# EAGLE design Controler 3_5 (EAGLE 9.0.0)
CNAME: Franks FlightSim Boards; CPROJECT: Franks FlightSim Boards; CREVISION: v0.1; DESIGNER: Frank van Ierland
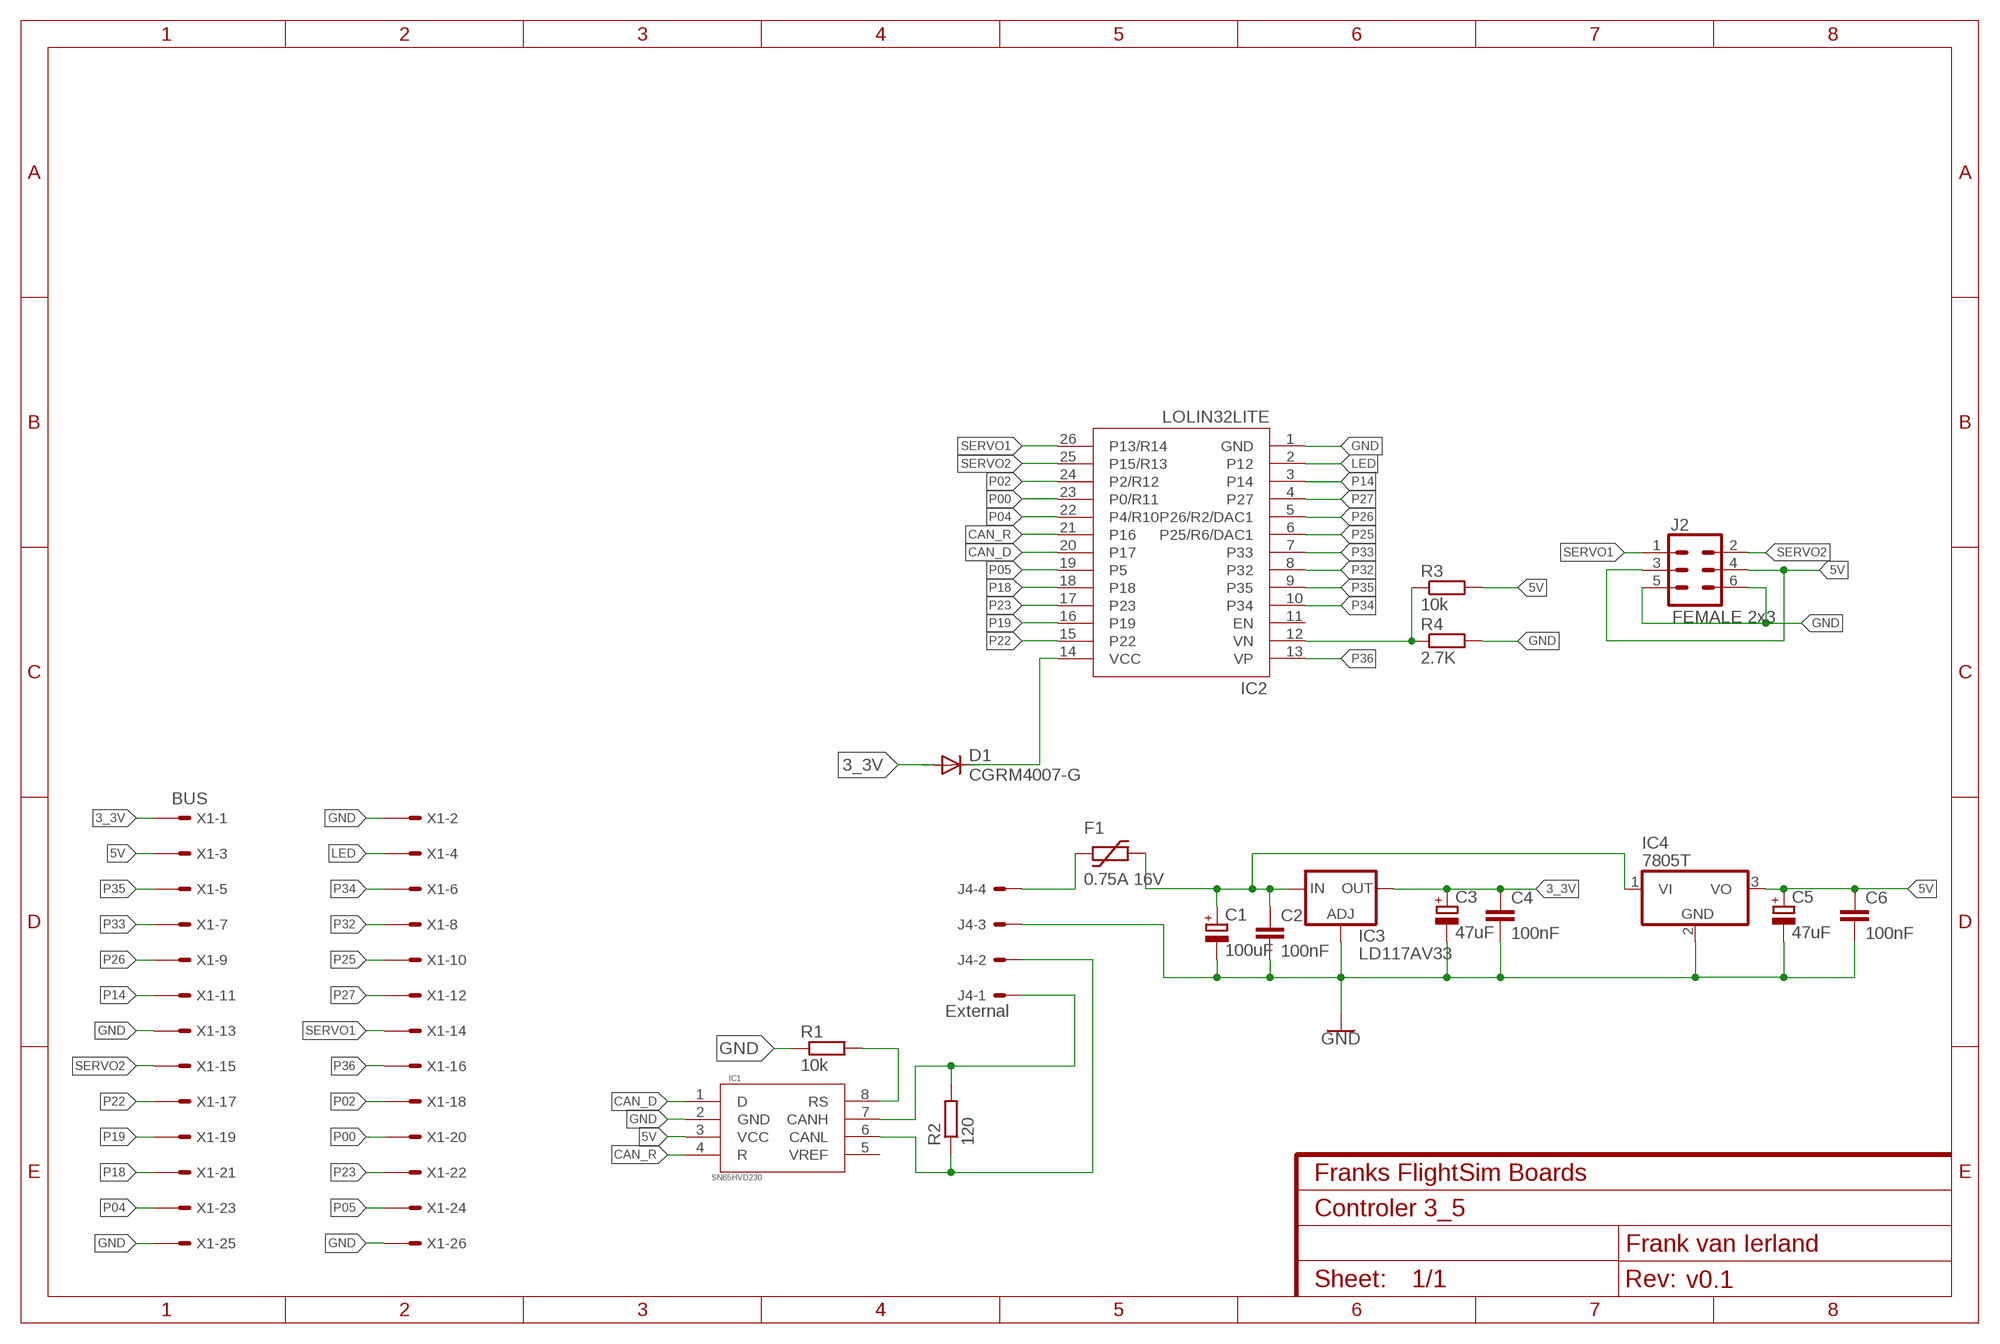
[diagram p0: schematic, sheet 1]

## Parts
C1  100uF  CPOL-EU153CLV-0505  [153CLV-0505]
C2  100nF  C-EUC0805  [C0805]
C3  47uF  CPOL-EUCT3528  [CT3528]
C4  100nF  C-EUC0805  [C0805]
C5  47uF  CPOL-EUCT3528  [CT3528]
C6  100nF  C-EUC0805  [C0805]
D1  CGRM4007-G  [SOD-123_MINI-SMA]
F1  0.75A 16V  1812L  [1812L]
IC1  SN65HVD230  [SO08]
IC2  LOLIN32LITE  [LOLIN32LITE]
IC3  LD117AV33  [TO220L1]
IC4  7805T  [TO220H]
J2  FEMALE 2x3  CONN_03X2FEMALE  [2X3]
J4  External  22-27-2041-04  [6410-04]
R1  10k  R-EU_M1206  [M1206]
R2  120  R-EU_R1210  [R1210]
R3  10k  R-EU_M1206  [M1206]
R4  2.7K  R-EU_M1206  [M1206]
X1  BUS  057-026-1  [057-026-1]

## Nets
3_3V [3_3V]: C3.+ C4.1 D1.A IC3.2(OUT) X1.1
5V [5V]: C5.+ C6.1 IC1.3(VCC) IC4.3(VO) J2.3 J2.4 R3.2 X1.3
12V [12V]: C1.+ C2.1 F1.2 IC3.3(IN) IC4.1(VI)
CAN_D: IC1.1(D) IC2.20(P17)
CAN_R: IC1.4(R) IC2.21(P16)
GND [GND]: C1.- C2.2 C3.- C4.2 C5.- C6.2 IC1.2(GND) IC2.1(GND) IC3.1(ADJ) IC4.2(GND) J2.5 J2.6 J4.3 R1.1 R4.2 X1.2 X1.13 X1.25 X1.26
LED [LED]: IC2.2(P12) X1.4
N$1: IC1.8(RS) R1.2
N$2: IC1.7(CANH) J4.1 R2.2
N$3: IC1.6(CANL) J4.2 R2.1
N$4 [12V]: F1.1 J4.4
N$5: D1.C IC2.14(VCC)
P00: IC2.23(P0/R11) X1.20
P02: IC2.24(P2/R12) X1.18
P04: IC2.22(P4/R10) X1.23
P05: IC2.19(P5) X1.24
P14: IC2.3(P14) X1.11
P18: IC2.18 X1.21
P19: IC2.16(P19) X1.19
P22: IC2.15(P22) X1.17
P23: IC2.17(P23) X1.22
P25: IC2.6(P25/R6/DAC1) X1.10
P26: IC2.5(P26/R2/DAC1) X1.9
P27: IC2.4(P27) X1.12
P32: IC2.8(P32) X1.8
P33: IC2.7(P33) X1.7
P34: IC2.10(P34) X1.6
P35: IC2.9(P35) X1.5
P36: IC2.13(VP) X1.16
P39: IC2.12(VN) R3.1 R4.1
SERVO1: IC2.26(P13/R14) J2.1 X1.14
SERVO2: IC2.25(P15/R13) J2.2 X1.15
Unconnected: IC1.5(VREF) IC2.11(EN)

## Library data of the parts
C1 C3 C5 = rcl:CPOL-EU: POLARIZED CAPACITOR, European symbol; SPICEPREFIX: C
C2 C4 C6 = resistor:C-EU: CAPACITOR, European symbol
D1 = diode:CGRM400*-G: Molded plasitc,JEDEC SOD-123/Mini SMA Source: Comchip CGRM4001-G.pdf
F1 = fuses:1812L: FUSE
IC1 = Franks:SN65HVD230
IC2 = Franks:LOLIN32LITE
IC3 = v-reg:LD117A?*: Low drop fixed and adjustable positive voltage regulators 1 A Source: http://www.st.com/stonline/products/literature/ds/7194/ld1117axx.pdf
IC4 = linear:78*: Positive VOLTAGE REGULATOR Source: http://cache.national.com/ds/LM/LM78L05.pdf http://www.fairchildsemi.com/ds/LM/LM7805.pdf
J2 = SparkFun-Connectors:CONN_03X2: Multi connection point. Often used as Generic Header-pin footprint for 0.1 inch spaced/style header connections You can populate with any combo of single row headers, but if you'd like an exact match, check these: Header - 2x3 (Male, 0.1") <https://www.sparkfun.com/products/12807> (PRT-12807) Header - 2x3 (Female, 0.1") <https://www.sparkfun.com/products/13010> (PRT-13010) 2x3 Pin Shrouded Header <https://www.sparkfun.com/products/10877> (PRT-10877) On any of the 0.1 inch spaced packages, you can populate with these: Break Away Headers - Straight <https://www.sparkfun.com/products/116> (PRT-00116) Break Away Male Headers - Right Angle <https://www.sparkfun.com/products/553> (PRT-00553) Female Headers <https://www.sparkfun.com/products/115> (PRT-00115) Break Away Headers - Machine Pin <https://www.sparkfun.com/products/117> (PRT-00117) Break Away Female Headers - Swiss Machine Pin <https://www.sparkfun.com/products/743> (PRT-00743) Special note: the shrouded connector mates well with our 3x2 ribbon cables: Ribbon Crimp Connector - 6-pin (2x3, Female) <https://www.sparkfun.com/products/10651> (PRT-10651) Ribbon Cable - 6 wire (15ft) <https://www.sparkfun.com/products/10646> (PRT-10646); PROD_ID: CONN-11566
J4 = con-molex:22-?-04: CONNECTOR wire to board 2.54 mm (.1 inch) pitch header; MF: MOLEX; OC_FARNELL: unknown; OC_NEWARK: unknown
R1-R4 = resistor:R-EU_: RESISTOR, European symbol
X1 = con-panduit:057-026-: CONNECTOR 20-pin series 057 contact pc board low profile headers; OC_FARNELL: unknown; OC_NEWARK: unknown

## Net classes
1 GND: width 0.508 mm
2 12V: width 0.762 mm
3 3_3V: width 0.508 mm
4 5V: width 0.508 mm
5 LED: width 0.508 mm

## Board
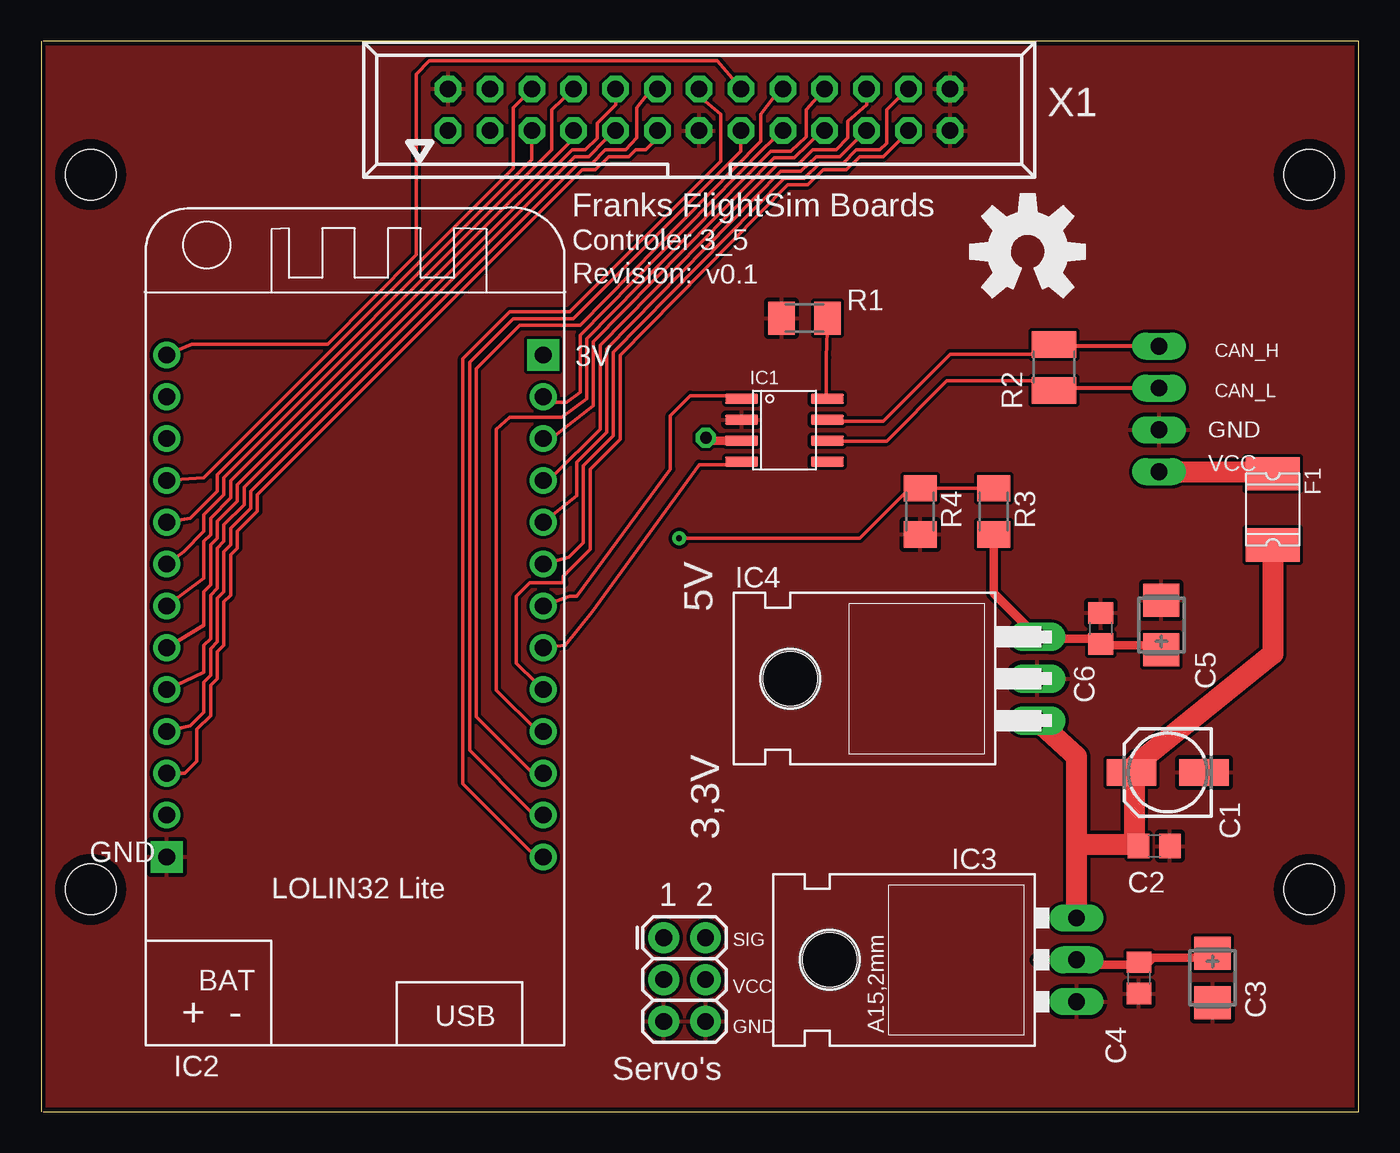
[diagram p1: board, top side]
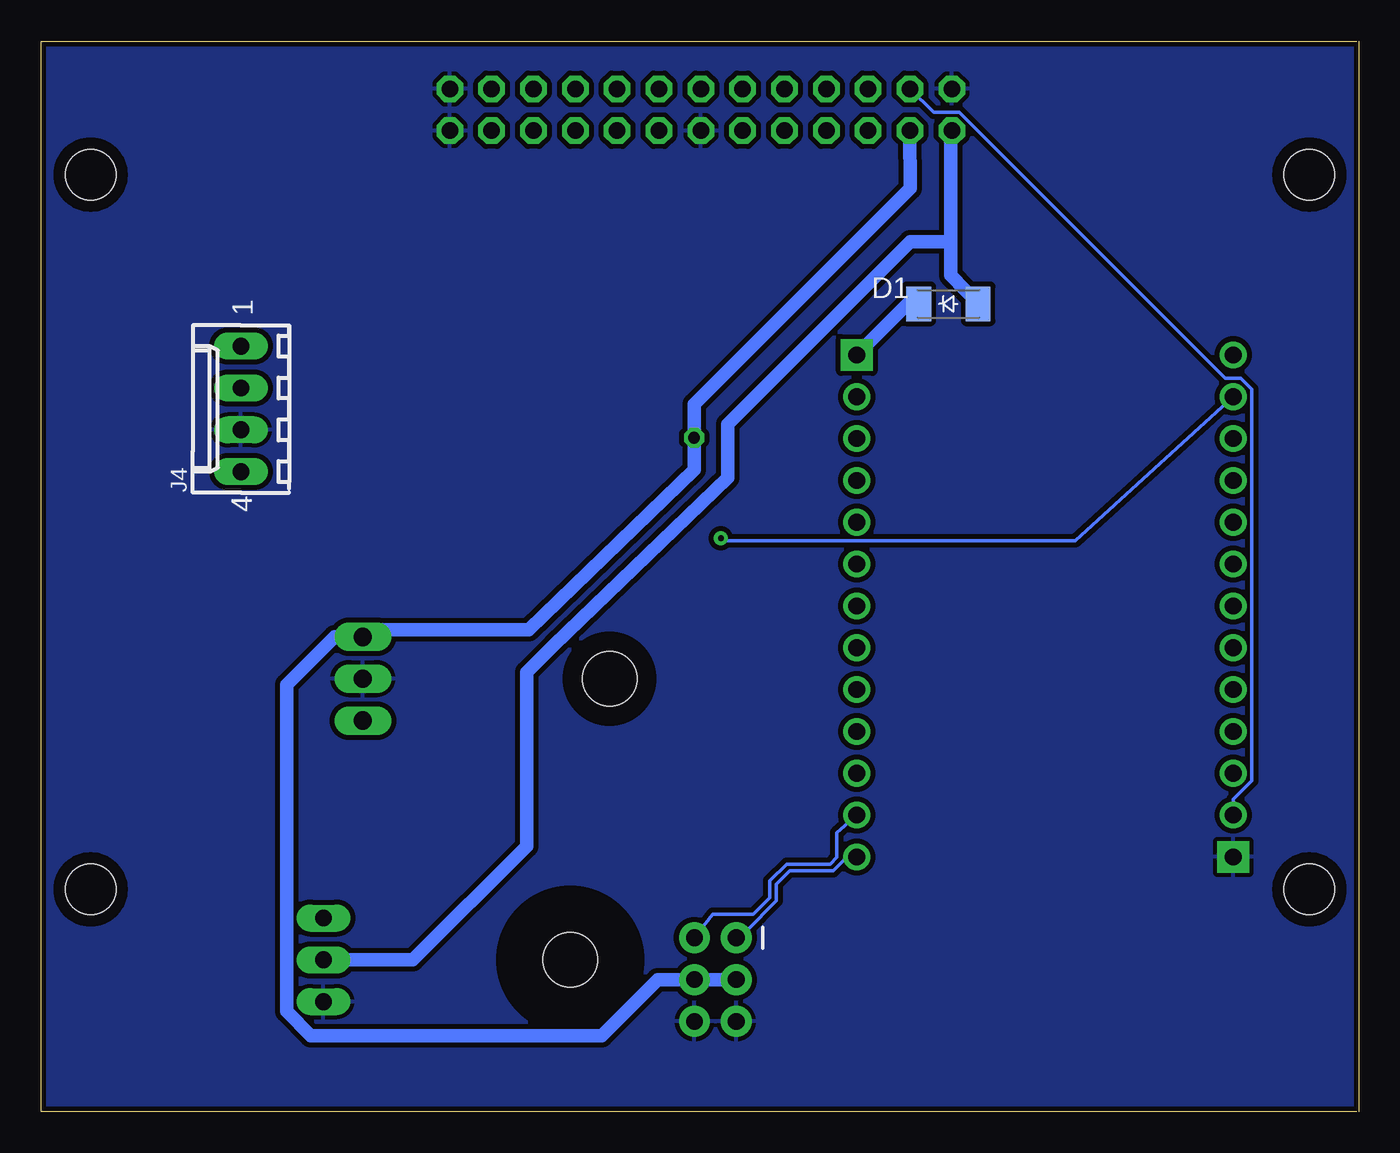
[diagram p2: board, bottom side, seen from below]

Size 80 x 65 mm. Coordinates in mm from the lower left corner, seen from the top.
Outline: 0.12,0 80,0 80,65 0.12,65
Outline: 0,65 0,0
Copper layers (1*16): Top 0.035mm / dielectric 1.5mm / Bottom 0.035mm
Design rules "SparkFun": minimum track width 8mil, minimum drill 20mil, track to track 8mil, track to pad 8mil, pad to pad 8mil, via to via 8mil, smd to smd 8mil, copper to edge 10mil, drill to drill 8mil, minimum pad ring 12mil, minimum via ring 10mil, stop-mask expansion 4mil, vias tented up to drill 25mil, thermal gap 10mil

### Footprints (pad centres in the part's own frame; a part is rotated, then mirrored left to right if it is on the bottom)
153CLV-0505 = smd 3 x 1.6: + 2.2,0; - -2.2,0
C0805 = smd 1.3 x 1.5: 1 -0.95,0; 2 0.95,0
CT3528 = smd 2 x 2.2: + -1.5,0; - 1.5,0
SOD-123_MINI-SMA = smd 1.5 x 2.1: A 1.8,0; C -1.8,0
1812L = smd 2.03 x 3.3: 1 -2.16,0; 2 2.16,0
SO08 = smd 2 x 0.6: 1 -2.6,1.905; 2 -2.6,0.635; 3 -2.6,-0.635; 4 -2.6,-1.905; 5 2.6,-1.905; 6 2.6,-0.635; 7 2.6,0.635; 8 2.6,1.905
LOLIN32LITE = drill 1.016 pad 1.93 square: 1 -11.43,-10.16; 14 11.43,20.32 | drill 1.016: 2 -11.43,-7.62; 3 -11.43,-5.08; 4 -11.43,-2.54; 5 -11.43,0; 6 -11.43,2.54; 7 -11.43,5.08; 8 -11.43,7.62; 9 -11.43,10.16; 10 -11.43,12.7; 11 -11.43,15.24; 12 -11.43,17.78; 13 -11.43,20.32; 15 11.43,17.78; 16 11.43,15.24; 17 11.43,12.7; 18 11.43,10.16; 19 11.43,7.62; 20 11.43,5.08; 21 11.43,2.54; 22 11.43,0; 23 11.43,-2.54; 24 11.43,-5.08; 25 11.43,-7.62; 26 11.43,-10.16
TO220L1 = drill 1.016 long: 1 -2.54,-3.81; 2 0,-3.81; 3 2.54,-3.81 | hole 3.302: 0,11.176
TO220H = drill 1.118 long: 1 -2.54,-10.16; 2 0,-10.16; 3 2.54,-10.16 | hole 3.302: 0,4.826
2X3 = drill 1.016 pad 1.88: 1 0,0; 2 0,2.54; 3 2.54,0; 4 2.54,2.54; 5 5.08,0; 6 5.08,2.54
6410-04 = drill 1.016 long: 1 3.81,0; 2 1.27,0; 3 -1.27,0; 4 -3.81,0
M1206 = smd 1.6 x 2: 1 -1.4,0; 2 1.4,0
R1210 = smd 1.6 x 2.7: 1 -1.4,0; 2 1.4,0
STAND-OFF-TIGHT = hole 3.048: 0,0
057-026-1 = drill 1 octagon: 1 -15.24,-1.27; 2 -15.24,1.27; 3 -12.7,-1.27; 4 -12.7,1.27; 5 -10.16,-1.27; 6 -10.16,1.27; 7 -7.62,-1.27; 8 -7.62,1.27; 9 -5.08,-1.27; 10 -5.08,1.27; 11 -2.54,-1.27; 12 -2.54,1.27; 13 0,-1.27; 14 0,1.27; 15 2.54,-1.27; 16 2.54,1.27; 17 5.08,-1.27; 18 5.08,1.27; 19 7.62,-1.27; 20 7.62,1.27; 21 10.16,-1.27; 22 10.16,1.27; 23 12.7,-1.27; 24 12.7,1.27; 25 15.24,-1.27; 26 15.24,1.27

### Placement (x,y rotation side)
C1  68.4,20.6 180 top
C2  67.59,16.13 0 top
C3  71.12,8.13 270 top
C4  66.65,8.13 270 top
C5  68.01,29.55 90 top
C6  64.33,29.34 90 top
D1  24.91,49.05 0 bottom
F1  74.78,36.58 270 top
IC1  45.13,41.38 0 top
IC2  19.05,25.63 0 top
IC3  59.05,9.22 90 top
IC4  50.31,26.29 90 top
J2  37.8,10.57 270 top
J4  67.87,42.67 90 bottom
R1  46.35,48.19 0 top
R2  61.49,45.19 90 top
R3  57.83,36.45 270 top
R4  53.36,36.45 270 top
U$10  [OSHW-LOGO-L]  59.9,52.22 0 top
U$13  [STAND-OFF-TIGHT]  3,56.9 0 top
U$14  [STAND-OFF-TIGHT]  77,56.9 0 top
U$15  [STAND-OFF-TIGHT]  3,13.5 0 top
U$16  [STAND-OFF-TIGHT]  77,13.5 0 top
X1  39.95,60.84 0 top

### Tracks (layer width: path | path; a pad name or v marks a point on that pad's centre or on a via)
3_3V
  Top 0.508: 60.47,9.22 IC3.2 64.21,8.94 66.24,8.94 66.38,9.08 C4.1 67.06,8.94 67.48,9.36 70.29,9.36 C3.+
  Bottom 0.508: X1.1 24.71,59.01 24.79,59.33
  Bottom 0.813: 24.79,59.33 24.79,52.83 | 24.79,52.83 27.23,52.83 38.33,41.74 38.33,38.48 48.89,28.32 50.52,26.7 50.52,16.13 57.43,9.22 IC3.2 | 24.79,52.83 24.79,50.8 D1.A
5V  (via drill 0.7)
  Top 0.508: IC1.3 40.53,40.74 v40.36,40.92 | C5.+ 67.18,28.32 64.74,28.32 C6.1 | C6.1 63.93,28.73 | C6.1 63.99,28.73 60.58,28.73 IC4.3 57.83,31.47 R3.2
  Bottom 0.508: 59.74,29.26 IC4.3
  Bottom 0.813: 59.74,29.26 50.39,29.26 40.36,38.99 v40.36,40.92 40.36,42.95 27.23,56.08 X1.3 | J2.3 J2.4 42.57,8.03 45.97,4.63 63.63,4.63 65.1,6.09 65.1,25.94 62.18,28.85 62.16,28.83 IC4.3
12V
  Top 1.016: 66.61,21.25 C1.+ 66.4,20.43 66.37,20.2 | 66.37,16.54 C2.1
  Top 1.27: 66.61,21.25 66.37,21.01 74.78,27.8 F1.2 | 66.37,20.2 66.37,16.54 | IC4.1 62.86,21.57 IC3.3 62.88,16.23 66.13,16.23 C2.1
CAN_D
  Top 0.203: IC1.1 42.27,43.48 39.42,43.48 38.2,42.27 38.2,39.01 32.51,31.29 32.11,31.29 IC2.20
CAN_R
  Top 0.203: IC1.4 41.58,39.3 39.95,39.3 33.45,30.36 31.82,28.32 IC2.21
GND
  pour Bottom (isolate 0.305): 0.2,65.01 0.12,55 0,55 0,0 80,0 80,55 79.88,64.75 74.93,65.01
  pour Top (isolate 0.203): 0.2,65.01 0.2,55 0,55 0,0 80,0 80,55 79.88,55 79.81,65.01
LED
  Bottom 0.203: IC2.2 7.62,18.97 6.5,20.09 6.5,43.88 7.16,44.53 8.1,44.53 24.25,60.68 25.82,60.68 X1.4
N$1
  Top 0.203: R1.2 47.67,45.8 47.67,43.36 IC1.8
N$2
  Top 0.203: R2.2 60.27,46 55.19,46 51.13,41.94 48.28,41.94 IC1.7 | R2.2 62.71,46.21 | 61.67,46.41 R2.2
  Top 0.254: J4.1 61.6,46.48 R2.2
N$3
  Top 0.203: IC1.6 48.48,40.72 51.33,40.72 54.99,44.38 60.27,44.38 R2.1 | R2.1 62.57,44.17 | 61.57,43.87 R2.1
  Top 0.254: J4.2 61.64,43.94 R2.1
N$4
  Top 1.27: J4.4 74.25,38.86 F1.1
N$5
  Bottom 0.813: IC2.14 27.38,49.05 D1.C
P00
  Top 0.203: IC2.23 30.15,23.09 27.64,25.6 27.64,41.45 28.45,42.16 31.6,42.16 33.12,43.28 33.12,46.94 44.3,58.32 45.52,58.32 46.45,59.21 46.45,60.84 X1.20
P02
  Top 0.203: IC2.24 29.67,20.73 26.42,23.98 26.42,45.11 29.06,47.75 32.72,47.75 43.69,58.93 43.69,60.55 44.88,62.11 X1.18
P04
  Top 0.203: IC2.22 30.04,26.04 28.85,27.23 28.85,31.29 29.67,32.11 31.7,32.11 31.7,32.51 33.33,34.14 33.33,39.01 35.15,40.84 35.15,45.92 45.31,56.29 46.53,56.29 47.47,57.18 48.89,57.18 49.7,57.99 51.13,57.99 52.65,59.52 X1.23
P05
  Top 0.203: IC2.19 32.03,33.66 32.92,34.54 32.92,39.22 34.75,41.05 34.75,46.13 45.11,56.69 46.33,56.69 47.27,57.59 48.69,57.59 49.5,58.4 50.92,58.4 51.33,58.8 51.33,60.84 52.6,62.11 X1.24
P14
  Top 0.203: X1.11 37.11,58.8 36.7,58.4 36.09,58.4 35.68,57.99 34.46,57.99 33.65,57.18 32.84,57.18 13.13,37.47 13.13,36.45 11.91,35.23 11.91,34.22 11.5,33.81 11.5,31.37 11.1,30.97 11.1,28.32 10.69,27.92 10.69,26.29 10.28,25.89 10.28,24.06 9.44,23.21 9.44,21.27 8.72,20.55 IC2.3
P18
  Top 0.203: IC2.18 32.51,37.39 32.51,39.42 34.34,41.25 34.34,46.33 44.91,57.1 46.13,57.1 47.06,57.99 48.48,57.99 49.7,59.21 X1.21
P19
  Top 0.203: IC2.16 31.09,41.05 31.29,41.15 33.53,42.88 33.53,46.74 44.5,57.91 45.72,57.91 47.42,59.57 X1.19
P22
  Top 0.203: IC2.15 30.89,43.08 31.9,43.08 32.72,43.69 32.72,47.14 43.89,58.52 X1.17
P23
  Top 0.203: IC2.17 31.02,38.33 31.09,38.61 33.93,41.45 33.93,46.53 44.7,57.51 45.92,57.51 46.86,58.4 48.28,58.4 48.97,59.13 48.97,60.15 50.11,61.14 X1.22
P25
  Top 0.203: IC2.6 9.88,29.54 9.88,31.58 10.28,31.98 10.28,34.42 10.69,34.83 10.69,35.84 11.91,37.06 11.91,38.08 32.23,58.4 33.04,58.4 33.76,59.12 33.76,60.03 34.87,61.14 X1.10
P26
  Top 0.203: IC2.5 9.88,26.7 9.88,28.32 10.28,28.73 10.28,31.37 10.69,31.78 10.69,34.22 11.1,34.62 11.1,35.64 12.31,36.86 12.31,37.91 32.4,57.99 33.24,57.99 34.26,59.01 X1.9
P27
  Top 0.203: IC2.4 9.06,23.45 9.88,24.26 9.88,26.09 10.28,26.5 10.28,28.12 10.69,28.53 10.69,31.17 11.1,31.58 11.1,34.01 11.5,34.42 11.5,35.44 12.72,36.66 12.72,37.67 32.63,57.59 33.45,57.59 34.26,58.4 35.48,58.4 36.17,59.13 36.17,60.96 36.7,61.65 X1.12
P32
  Top 0.203: IC2.8 8.66,34.01 9.88,35.23 9.88,36.25 11.1,37.47 11.1,38.48 31.01,58.4 31.01,60.84 X1.8
P33
  Top 0.203: IC2.7 9.88,32.39 9.88,34.62 10.28,35.03 10.28,36.05 11.5,37.27 11.5,38.32 27.25,54.03 30.6,57.38 32.03,58.8 X1.7
P34
  Top 0.203: IC2.10 9.87,38.49 28.67,57.28 28.65,60.96 29.79,62.06 X1.6
P35
  Top 0.203: IC2.9 9.06,36.05 10.69,37.67 10.69,38.69 29.79,57.79 X1.5
P36
  Top 0.203: IC2.13 9.15,46.61 17.39,46.61 22.76,52.02 22.76,62.99 23.57,63.8 41.05,63.8 X1.16
P39  (via drill 0.35)
  Top 0.203: R3.1 R4.1 52.73,37.85 49.7,34.83 v38.73,34.83
  Bottom 0.203: v38.73,34.83 38.77,34.83 38.62,34.67 17.22,34.67 IC2.12
SERVO1
  Top 0.203: IC2.26 29.67,15.85 25.6,19.91 25.6,45.72 28.45,48.56 32.11,48.56 41.25,57.71 41.25,60.55 39.95,61.65 X1.14
  Bottom 0.203: IC2.26 30.89,15.44 31.09,15.44 31.9,14.63 34.54,14.63 35.36,13.82 35.36,12.8 37.19,10.97 J2.1
SERVO2
  Top 0.203: IC2.25 29.67,18.29 26.01,21.95 26.01,45.52 28.65,48.16 32.31,48.16 42.47,58.32 42.47,58.93 42.49,58.91 X1.15
  Bottom 0.203: IC2.25 31.7,16.95 31.7,15.44 32.11,15.04 34.75,15.04 35.76,14.02 35.76,13.01 36.78,11.99 39.22,11.99 J2.2

### Text on the board
tNames: Revision: | CAN_H | CAN_L | GND | VCC | 5V | 3,3V | 1 2 | SIG | VCC | GND | Servo's